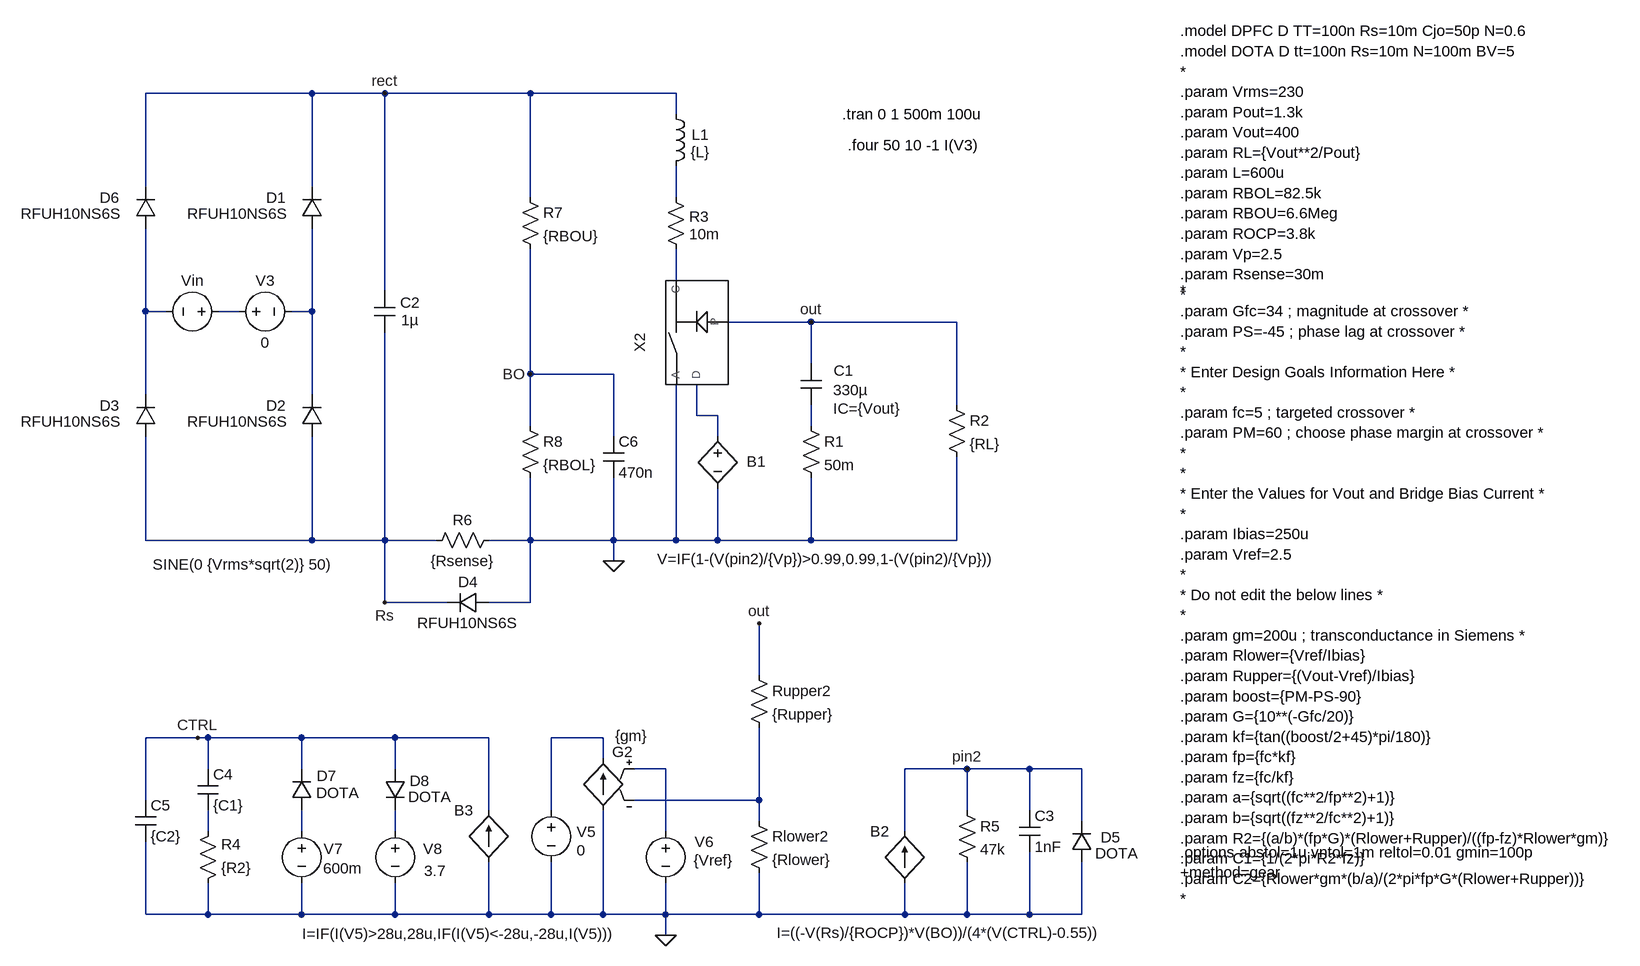
[diagram p0: schematic Boost CCM PFC - avg - fixed load.asc]
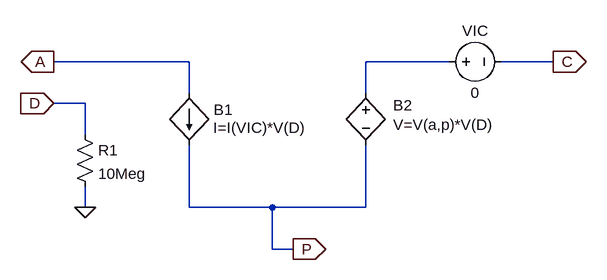
[diagram p1: sub-circuit pwmvm.asc]
Boost CCM PFC - avg - fixed load.asc, the LTspice schematic file:
Version 4
SHEET 1 2292 1256
WIRE -272 -192 -528 -192
WIRE -160 -192 -272 -192
WIRE 64 -192 -160 -192
WIRE 288 -192 64 -192
WIRE 288 -160 288 -192
WIRE -528 -48 -528 -192
WIRE -272 -48 -272 -192
WIRE 64 -32 64 -192
WIRE 288 -32 288 -80
WIRE 288 96 288 48
WIRE -160 112 -160 -192
WIRE -528 144 -528 16
WIRE -496 144 -528 144
WIRE -384 144 -416 144
WIRE -272 144 -272 16
WIRE -272 144 -304 144
WIRE 496 160 368 160
WIRE 720 160 496 160
WIRE 496 224 496 160
WIRE 64 240 64 48
WIRE 192 240 64 240
WIRE -528 272 -528 144
WIRE -272 272 -272 144
WIRE 720 288 720 160
WIRE 320 304 320 256
WIRE 352 304 320 304
WIRE 64 320 64 240
WIRE 496 320 496 288
WIRE 192 336 192 240
WIRE 352 336 352 304
WIRE -528 496 -528 336
WIRE -272 496 -272 336
WIRE -272 496 -528 496
WIRE -160 496 -160 176
WIRE -160 496 -272 496
WIRE -80 496 -160 496
WIRE 64 496 64 400
WIRE 64 496 0 496
WIRE 192 496 192 400
WIRE 192 496 64 496
WIRE 288 496 288 256
WIRE 288 496 192 496
WIRE 352 496 352 416
WIRE 352 496 288 496
WIRE 496 496 496 400
WIRE 496 496 352 496
WIRE 720 496 720 368
WIRE 720 496 496 496
WIRE 192 528 192 496
WIRE -160 592 -160 496
WIRE -64 592 -160 592
WIRE 64 592 64 496
WIRE 64 592 0 592
WIRE 416 704 416 624
WIRE -448 800 -528 800
WIRE -432 800 -448 800
WIRE -288 800 -432 800
WIRE -144 800 -288 800
WIRE 0 800 -144 800
WIRE 176 800 96 800
WIRE 176 832 176 800
WIRE -432 848 -432 800
WIRE -288 848 -288 800
WIRE -144 848 -144 800
WIRE 272 848 224 848
WIRE 736 848 640 848
WIRE 832 848 736 848
WIRE 912 848 832 848
WIRE -528 896 -528 800
WIRE 416 896 416 784
WIRE 416 896 224 896
WIRE 0 912 0 800
WIRE 96 912 96 800
WIRE 736 912 736 848
WIRE 832 912 832 848
WIRE 416 928 416 896
WIRE 912 928 912 848
WIRE -432 944 -432 912
WIRE -288 944 -288 912
WIRE -144 944 -144 912
WIRE 272 944 272 848
WIRE 640 944 640 848
WIRE -528 1072 -528 960
WIRE -432 1072 -432 1024
WIRE -432 1072 -528 1072
WIRE -288 1072 -288 1024
WIRE -288 1072 -432 1072
WIRE -144 1072 -144 1024
WIRE -144 1072 -288 1072
WIRE 0 1072 0 992
WIRE 0 1072 -144 1072
WIRE 96 1072 96 992
WIRE 96 1072 0 1072
WIRE 176 1072 176 912
WIRE 176 1072 96 1072
WIRE 272 1072 272 1024
WIRE 272 1072 176 1072
WIRE 416 1072 416 1008
WIRE 416 1072 272 1072
WIRE 640 1072 640 1024
WIRE 640 1072 416 1072
WIRE 736 1072 736 992
WIRE 736 1072 640 1072
WIRE 832 1072 832 976
WIRE 832 1072 736 1072
WIRE 912 1072 912 992
WIRE 912 1072 832 1072
WIRE 272 1104 272 1072
FLAG 496 160 out
FLAG -160 -192 rect
FLAG 272 1104 0
FLAG -448 800 CTRL
FLAG 416 624 out
FLAG 736 848 pin2
FLAG 64 240 BO
FLAG 192 528 0
FLAG -160 592 Rs
DATAFLAG 592 160 ""
DATAFLAG 352 896 ""
SYMBOL cap 480 224 R0
WINDOW 0 51 11 Left 2
WINDOW 3 50 41 Left 2
WINDOW 123 50 69 Left 2
SYMATTR InstName C1
SYMATTR Value 330µ
SYMATTR Value2 IC={Vout}
SYMBOL res 480 304 R0
SYMATTR InstName R1
SYMATTR Value 50m
SYMBOL res 704 272 R0
SYMATTR InstName R2
SYMATTR Value {RL}
SYMBOL res 272 -48 R0
WINDOW 0 36 46 Left 2
WINDOW 3 36 73 Left 2
SYMATTR InstName R3
SYMATTR Value 10m
SYMBOL ind 272 -176 R0
WINDOW 0 40 48 Left 2
WINDOW 3 39 75 Left 2
SYMATTR InstName L1
SYMATTR Value {L}
SYMBOL cap -176 112 R0
WINDOW 0 40 18 Left 2
WINDOW 3 41 45 Left 2
SYMATTR InstName C2
SYMATTR Value 1µ
SYMBOL voltage -400 144 R90
WINDOW 0 -32 56 VBottom 2
WINDOW 3 374 -22 VTop 2
WINDOW 123 0 0 Left 0
WINDOW 39 0 0 Left 0
SYMATTR InstName Vin
SYMATTR Value SINE(0 {Vrms*sqrt(2)} 50)
SYMBOL voltage -400 144 R270
WINDOW 0 32 56 VTop 2
WINDOW 3 -32 56 VBottom 2
WINDOW 123 0 0 Left 0
WINDOW 39 0 0 Left 0
SYMATTR InstName V3
SYMATTR Value 0
SYMBOL bv 352 320 R0
WINDOW 0 45 55 Left 2
WINDOW 3 -93 205 Left 2
SYMATTR InstName B1
SYMATTR Value V=IF(1-(V(pin2)/{Vp})>0.99,0.99,1-(V(pin2)/{Vp}))
SYMBOL res 400 912 R0
SYMATTR InstName Rlower2
SYMATTR Value {Rlower}
SYMBOL res 400 688 R0
SYMATTR InstName Rupper2
SYMATTR Value {Rupper}
SYMBOL voltage 272 928 R0
WINDOW 0 45 32 Left 2
WINDOW 3 43 61 Left 2
WINDOW 123 0 0 Left 0
WINDOW 39 0 0 Left 0
SYMATTR InstName V6
SYMATTR Value {Vref}
SYMBOL g 176 816 M0
WINDOW 0 -46 6 Left 2
WINDOW 3 -69 -19 Left 2
SYMATTR InstName G2
SYMATTR Value {gm}
SYMBOL diode -272 912 R180
WINDOW 0 -38 53 Left 2
WINDOW 3 -73 27 Left 2
SYMATTR InstName D7
SYMATTR Value DOTA
SYMBOL diode -160 848 R0
WINDOW 0 38 18 Left 2
WINDOW 3 36 43 Left 2
SYMATTR InstName D8
SYMATTR Value DOTA
SYMBOL voltage -288 928 R0
WINDOW 0 34 43 Left 2
WINDOW 3 33 73 Left 2
WINDOW 123 0 0 Left 0
WINDOW 39 0 0 Left 0
SYMATTR InstName V7
SYMATTR Value 600m
SYMBOL voltage -144 928 R0
WINDOW 0 43 43 Left 2
WINDOW 3 45 77 Left 2
WINDOW 123 0 0 Left 0
WINDOW 39 0 0 Left 0
SYMATTR InstName V8
SYMATTR Value 3.7
SYMBOL voltage 96 896 R0
WINDOW 0 39 49 Left 2
WINDOW 3 39 77 Left 2
SYMATTR InstName V5
SYMATTR Value 0
SYMBOL bi 0 992 R180
WINDOW 0 24 80 Left 2
WINDOW 3 -202 -110 Left 2
SYMATTR InstName B3
SYMATTR Value I=IF(I(V5)>28u,28u,IF(I(V5)<-28u,-28u,I(V5)))
SYMBOL cap -448 912 M180
WINDOW 0 24 56 Left 2
WINDOW 3 24 8 Left 2
SYMATTR InstName C4
SYMATTR Value {C1}
SYMBOL res -448 1040 M180
WINDOW 0 36 76 Left 2
WINDOW 3 36 40 Left 2
SYMATTR InstName R4
SYMATTR Value {R2}
SYMBOL cap -544 960 M180
WINDOW 0 24 56 Left 2
WINDOW 3 24 8 Left 2
SYMATTR InstName C5
SYMATTR Value {C2}
SYMBOL PWMVM 304 192 R270
SYMATTR InstName X2
SYMBOL bi 640 1024 R180
WINDOW 0 24 80 Left 2
WINDOW 3 -308 -76 Left 2
SYMATTR InstName B2
SYMATTR Value I=((-V(Rs)/{ROCP})*V(BO))/(4*(V(CTRL)-0.55))
SYMBOL res 720 896 R0
SYMATTR InstName R5
SYMATTR Value 47k
SYMBOL cap 816 912 R0
SYMATTR InstName C3
SYMATTR Value 1nF
SYMBOL res 16 480 R90
WINDOW 0 0 56 VBottom 2
WINDOW 3 32 56 VTop 2
SYMATTR InstName R6
SYMATTR Value {Rsense}
SYMBOL res 48 -48 R0
SYMATTR InstName R7
SYMATTR Value {RBOU}
SYMBOL res 48 304 R0
SYMATTR InstName R8
SYMATTR Value {RBOL}
SYMBOL cap 176 336 R0
SYMATTR InstName C6
SYMATTR Value 470n
SYMBOL diode -512 16 R180
WINDOW 0 56 47 Left 2
WINDOW 3 52 23 Left 2
SYMATTR InstName D6
SYMATTR Value RFUH10NS6S
SYMBOL diode -256 16 R180
WINDOW 0 56 47 Left 2
WINDOW 3 52 23 Left 2
SYMATTR InstName D1
SYMATTR Value RFUH10NS6S
SYMBOL diode -256 336 R180
WINDOW 0 56 47 Left 2
WINDOW 3 52 23 Left 2
SYMATTR InstName D2
SYMATTR Value RFUH10NS6S
SYMBOL diode -512 336 R180
WINDOW 0 56 47 Left 2
WINDOW 3 52 23 Left 2
SYMATTR InstName D3
SYMATTR Value RFUH10NS6S
SYMBOL diode 0 576 R90
WINDOW 0 0 32 VBottom 2
WINDOW 3 32 32 VTop 2
SYMATTR InstName D4
SYMATTR Value RFUH10NS6S
SYMBOL diode 928 992 R180
WINDOW 0 -44 39 Left 2
WINDOW 3 -72 14 Left 2
SYMATTR InstName D5
SYMATTR Value DOTA
TEXT 1064 -288 Left 2 !.model DPFC D TT=100n Rs=10m Cjo=50p N=0.6\n.model DOTA D tt=100n Rs=10m N=100m BV=5\n*\n.param Vrms=230\n.param Pout=1.3k\n.param Vout=400\n.param RL={Vout**2/Pout}\n.param L=600u\n.param RBOL=82.5k\n.param RBOU=6.6Meg\n.param ROCP=3.8k\n.param Vp=2.5\n.param Rsense=30m\n*
TEXT 544 -160 Left 2 !.tran 0 1 500m 100u
TEXT 1064 976 Left 2 !.options abstol=1u vntol=1m reltol=0.01 gmin=100p\n+method=gear
TEXT 1064 112 Left 2 !*\n.param Gfc=34 ; magnitude at crossover *\n.param PS=-45 ; phase lag at crossover *\n*\n* Enter Design Goals Information Here *\n*\n.param fc=5 ; targeted crossover *\n.param PM=60 ; choose phase margin at crossover *\n*\n*\n* Enter the Values for Vout and Bridge Bias Current *\n*\n.param Ibias=250u\n.param Vref=2.5\n*\n* Do not edit the below lines *\n*\n.param gm=200u ; transconductance in Siemens *\n.param Rlower={Vref/Ibias}\n.param Rupper={(Vout-Vref)/Ibias}\n.param boost={PM-PS-90}\n.param G={10**(-Gfc/20)}\n.param kf={tan((boost/2+45)*pi/180)}\n.param fp={fc*kf}\n.param fz={fc/kf}\n.param a={sqrt((fc**2/fp**2)+1)}\n.param b={sqrt((fz**2/fc**2)+1)}\n.param R2={(a/b)*(fp*G)*(Rlower+Rupper)/((fp-fz)*Rlower*gm)}\n.param C1={1/(2*pi*R2*fz)}\n.param C2={Rlower*gm*(b/a)/(2*pi*fp*G*(Rlower+Rupper))}\n*
TEXT 552 -112 Left 2 !.four 50 10 -1 I(V3)

pwmvm.asc, the sub-circuit schematic file:
Version 4
SHEET 1 880 680
WIRE 64 48 -144 48
WIRE 464 48 336 48
WIRE 624 48 544 48
WIRE 64 96 64 48
WIRE 336 96 336 48
WIRE -96 112 -144 112
WIRE -96 160 -96 112
WIRE -96 272 -96 240
WIRE 64 272 64 176
WIRE 192 272 64 272
WIRE 336 272 336 176
WIRE 336 272 192 272
WIRE 192 336 192 272
WIRE 224 336 192 336
FLAG -96 272 0
FLAG -144 48 A
IOPIN -144 48 Out
FLAG 624 48 C
IOPIN 624 48 Out
FLAG 224 336 P
IOPIN 224 336 Out
FLAG -144 112 D
IOPIN -144 112 In
SYMBOL bi 64 96 R0
WINDOW 0 38 26 Left 2
WINDOW 3 37 53 Left 2
SYMATTR InstName B1
SYMATTR Value I=I(VIC)*V(D)
SYMBOL bv 336 80 R0
WINDOW 0 42 35 Left 2
WINDOW 3 42 65 Left 2
SYMATTR InstName B2
SYMATTR Value V=V(a,p)*V(D)
SYMBOL voltage 448 48 R270
WINDOW 0 32 56 VTop 2
WINDOW 3 -32 56 VBottom 2
WINDOW 123 0 0 Left 0
WINDOW 39 0 0 Left 0
SYMATTR InstName VIC
SYMATTR Value 0
SYMBOL res -112 144 R0
SYMATTR InstName R1
SYMATTR Value 10Meg

The netlist it stands for:
* Boost CCM PFC - avg - fixed load.asc
C1 out N007 330µ IC={Vout}
R1 N007 0 50m
R2 out 0 {RL}
R3 N001 N002 10m
L1 rect N001 {L}
C2 rect Rs 1µ
Vin N004 N003 SINE(0 {Vrms*sqrt(2)} 50)
V3 N004 N005 0
B1 N006 0 V=IF(1-(V(pin2)/{Vp})>0.99,0.99,1-(V(pin2)/{Vp}))
Rlower2 N010 0 {Rlower}
Rupper2 out N010 {Rupper}
V6 N009 0 {Vref}
G2 0 N008 N009 N010 {gm}
D7 N012 CTRL DOTA
D8 CTRL N013 DOTA
V7 N012 0 600m
V8 N013 0 3.7
V5 N008 0 0
B3 0 CTRL I=IF(I(V5)>28u,28u,IF(I(V5)<-28u,-28u,I(V5)))
C4 N011 CTRL {C1}
R4 0 N011 {R2}
C5 0 CTRL {C2}
XX2 N006 0 N002 out pwmvm
B2 0 pin2 I=((-V(Rs)/{ROCP})*V(BO))/(4*(V(CTRL)-0.55))
R5 pin2 0 47k
C3 pin2 0 1nF
R6 0 Rs {Rsense}
R7 rect BO {RBOU}
R8 BO 0 {RBOL}
C6 BO 0 470n
D6 N003 rect RFUH10NS6S
D1 N005 rect RFUH10NS6S
D2 Rs N005 RFUH10NS6S
D3 Rs N003 RFUH10NS6S
D4 0 Rs RFUH10NS6S
D5 0 pin2 DOTA

* block symbol definitions
.subckt pwmvm D A C P
B1 A P I=I(VIC)*V(D)
B2 N001 P V=V(a,p)*V(D)
VIC N001 C 0
R1 D 0 10Meg
.ends pwmvm

.model D D
.lib standard.dio
.model DPFC D TT=100n Rs=10m Cjo=50p N=0.6
.model DOTA D tt=100n Rs=10m N=100m BV=5
*
.param Vrms=230
.param Pout=1.3k
.param Vout=400
.param RL={Vout**2/Pout}
.param L=600u
.param RBOL=82.5k
.param RBOU=6.6Meg
.param ROCP=3.8k
.param Vp=2.5
.param Rsense=30m
*
.tran 0 1 500m 100u
.options abstol=1u vntol=1m reltol=0.01 gmin=100p
+method=gear
*
.param Gfc=34 ; magnitude at crossover *
.param PS=-45 ; phase lag at crossover *
*
* Enter Design Goals Information Here *
*
.param fc=5 ; targeted crossover *
.param PM=60 ; choose phase margin at crossover *
*
*
* Enter the Values for Vout and Bridge Bias Current *
*
.param Ibias=250u
.param Vref=2.5
*
* Do not edit the below lines *
*
.param gm=200u ; transconductance in Siemens *
.param Rlower={Vref/Ibias}
.param Rupper={(Vout-Vref)/Ibias}
.param boost={PM-PS-90}
.param G={10**(-Gfc/20)}
.param kf={tan((boost/2+45)*pi/180)}
.param fp={fc*kf}
.param fz={fc/kf}
.param a={sqrt((fc**2/fp**2)+1)}
.param b={sqrt((fz**2/fc**2)+1)}
.param R2={(a/b)*(fp*G)*(Rlower+Rupper)/((fp-fz)*Rlower*gm)}
.param C1={1/(2*pi*R2*fz)}
.param C2={Rlower*gm*(b/a)/(2*pi*fp*G*(Rlower+Rupper))}
*
.four 50 10 -1 I(V3)
.backanno
.end